# EAGLE design RC _TX (EAGLE 7.7.0)
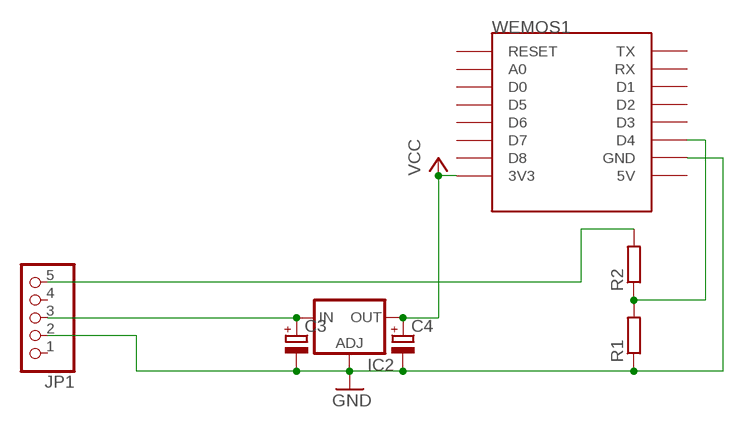
[diagram p0: schematic, sheet 1]

## Parts
C3  CPOL-EUE2,5-6E  [E2,5-6E]
C4  CPOL-EUE2,5-6E  [E2,5-6E]
IC2  LM317TS  [317TS]
JP1  PINHD-1X5  [1X05]
R1  R-EU_0207/10  [0207/10]
R2  R-EU_0207/10  [0207/10]
WEMOS1  WEMOS-D1-MINI  [WEMOS-D1-MINI]

## Nets
GND: C3.- C4.- IC2.1(ADJ) JP1.2 R1.1 WEMOS1.GND
N$3: C3.+ IC2.3(IN) JP1.3
N$5: R1.2 R2.1 WEMOS1.D4
N$6: JP1.5 R2.2
VCC: C4.+ IC2.2(OUT) WEMOS1.3V3
Unconnected: JP1.1 JP1.4 WEMOS1.5V WEMOS1.A0 WEMOS1.D0 WEMOS1.D1 WEMOS1.D2 WEMOS1.D3 WEMOS1.D5 WEMOS1.D6 WEMOS1.D7 WEMOS1.D8 WEMOS1.RESET WEMOS1.RX WEMOS1.TX

## Library data of the parts
C3 C4 = rcl:CPOL-EU: POLARIZED CAPACITOR, European symbol
IC2 = v-reg:LM317TS: VOLTAGE REGULATOR
JP1 = pinhead:PINHD-1X5: PIN HEADER
R1 R2 = rcl:R-EU_: RESISTOR, European symbol
WEMOS1 = esp8266modules:WEMOS-D1-MINI: WeMos.cc D1 mini ESP8266 module

## Net classes
0 default: width 1.143 mm, clearance 0.355 mm

## Board
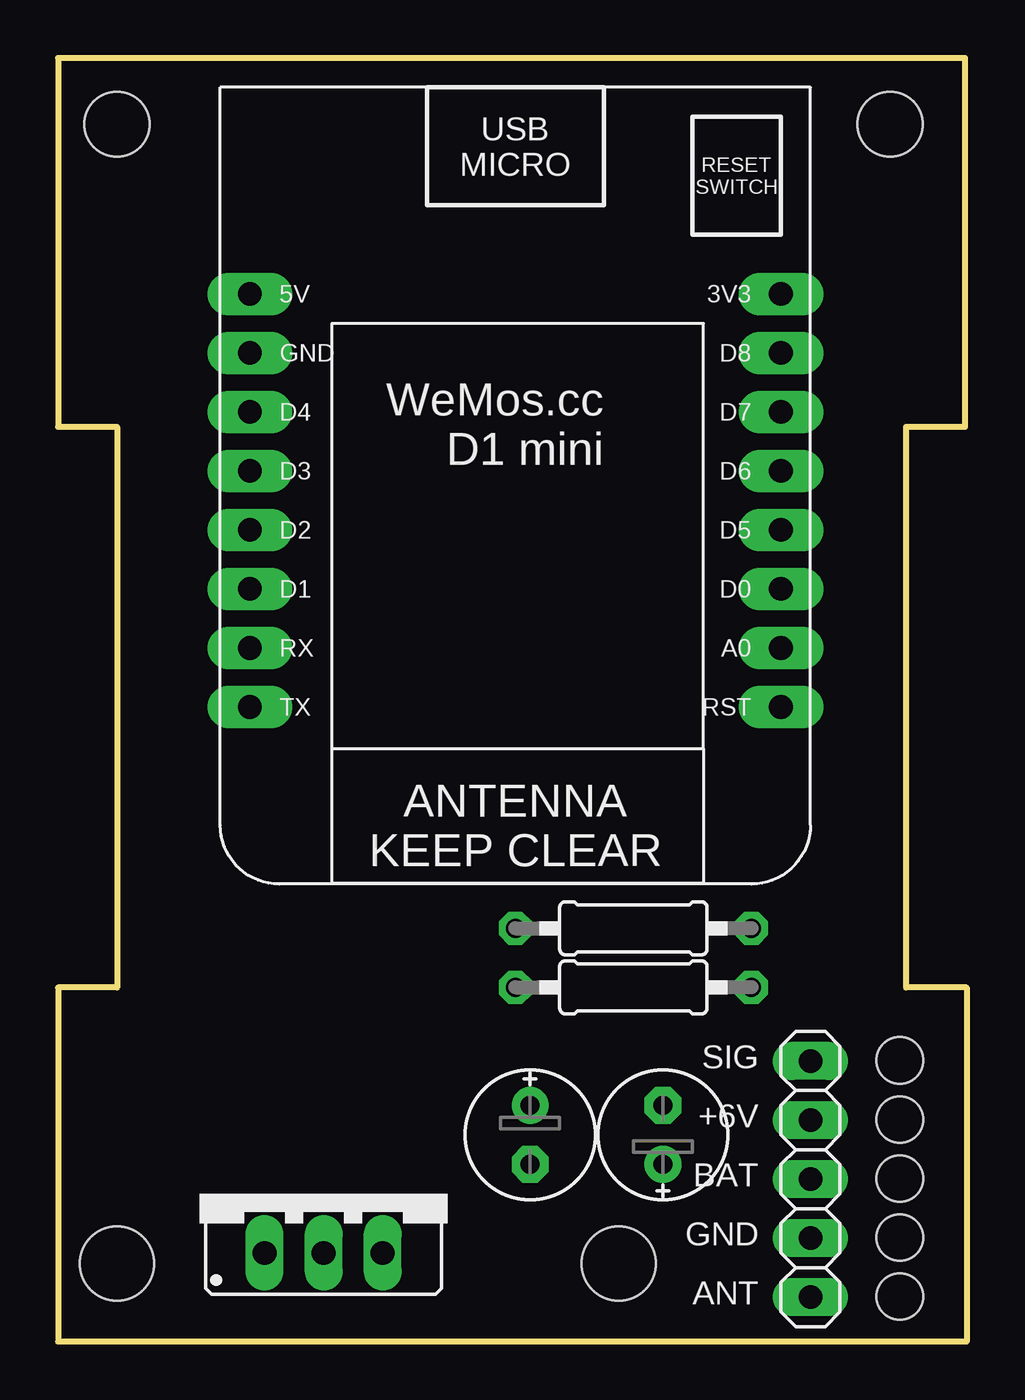
[diagram p1: board, top side]
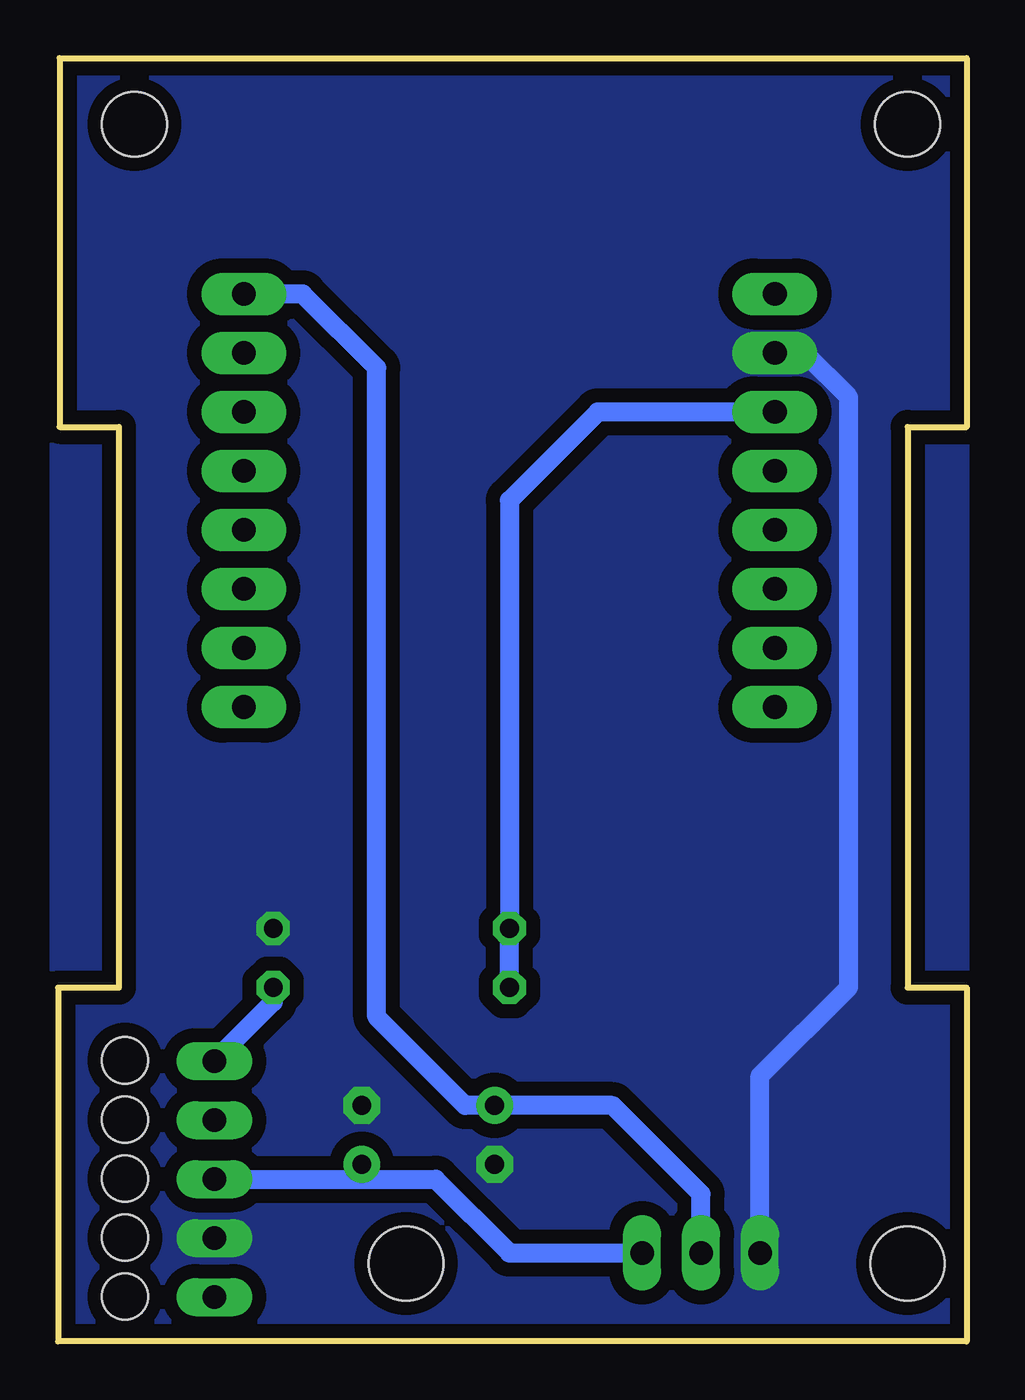
[diagram p2: board, bottom side, seen from below]

Size 39.11 x 55.23 mm. Coordinates in mm from the lower left corner, seen from the top.
Outline: 2.54,15.23 0,15.23 0,0 39.11,0 39.11,15.23 36.5,15.23 36.5,39.36 39.04,39.36 39.04,55.23 0,55.23 0,39.36 2.54,39.36 2.54,15.23
Copper layers (1*16): Top 0.035mm / dielectric 1.5mm / Bottom 0.035mm
Design rules "default *": minimum track width 12mil, minimum drill 24mil, track to track 8mil, track to pad 8mil, pad to pad 8mil, via to via 8mil, smd to smd 8mil, copper to edge 4mil, drill to drill 8mil, minimum pad ring 12mil, minimum via ring 12mil, stop-mask expansion 4mil, vias tented up to drill 0mil, thermal gap 10mil
Holes 3.2 mm at 24.13,3.36 2.54,3.36
Holes 2 mm at 36.23,1.93 36.23,4.47 36.23,7.01 36.23,9.55 36.23,12.09
Holes 2.8 mm at 2.54,52.39 35.82,52.39

### Footprints (pad centres in the part's own frame; a part is rotated, then mirrored left to right if it is on the bottom)
E2,5-6E = drill 0.813 pad 1.575: + -1.27,0 | drill 0.813 pad 1.575 octagon: - 1.27,0
317TS = drill 1.016 long: 1 -2.54,-2.54; 2 0,-2.54; 3 2.54,-2.54
1X05 = drill 1.016 long: 1 -5.08,0; 2 -2.54,0; 3 0,0; 4 2.54,0; 5 5.08,0
0207/10 = drill 0.813 octagon: 1 -5.08,0; 2 5.08,0
WEMOS-D1-MINI = drill 1.016 pad 1.829 long: 3V3 -10.16,-10.16; 5V 12.7,-10.16; A0 -10.16,5.08; D0 -10.16,2.54; D1 12.7,2.54; D2 12.7,0; D3 12.7,-2.54; D4 12.7,-5.08; D5 -10.16,0; D6 -10.16,-2.54; D7 -10.16,-5.08; D8 -10.16,-7.62; GND 12.7,-7.62; RESET -10.16,7.62; RX 12.7,5.08; TX 12.7,7.62

### Placement (x,y rotation side)
C3  26.04,8.89 90 top
C4  20.32,8.89 270 top
IC2  11.43,6.35 0 top
JP1  32.38,6.99 90 top
R1  24.77,17.78 180 top
R2  24.77,15.24 0 top
WEMOS1  20.95,34.92 180 top

### Tracks (layer width: path | path; a pad name or v marks a point on that pad's centre or on a via)
GND
  Bottom 0.813: IC2.1 8.89,11.43 5.08,15.24 5.08,40.64 6.99,42.55 WEMOS1.GND
  pour Bottom (isolate 0.61, no thermals): 0,55.24 39.37,55.24 39.37,0 0,0
N$3
  Bottom 0.813: JP1.3 26.04,6.99 | 26.04,6.99 22.86,6.99 19.68,3.81 IC2.3 | C3.+ 26.04,6.99
N$5
  Bottom 0.813: R2.1 R1.2 19.68,36.2 15.88,40.01 WEMOS1.D4
N$6
  Bottom 0.813: R2.2 29.84,14.61 JP1.5
VCC
  Bottom 0.813: IC2.2 11.43,6.35 15.24,10.16 C4.+ 21.59,10.16 25.4,13.97 25.4,41.91 28.57,45.09 WEMOS1.3V3

### Text on the board
tNames: SIG | +6V | BAT | GND | ANT